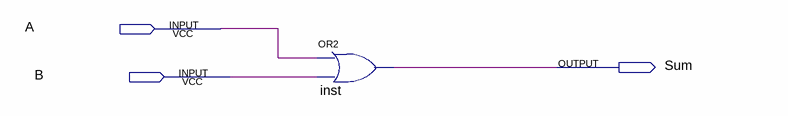
[diagram p0: schematic sheet]
// Quartus schematic func.bdf as structural Verilog: 1 symbols, 3 pins
module func (
  input  A,
  input  B,
  output Sum
);

  or inst (Sum, A, B);
endmodule
